# EAGLE schematic motor_driver_analog (EAGLE 6.2)
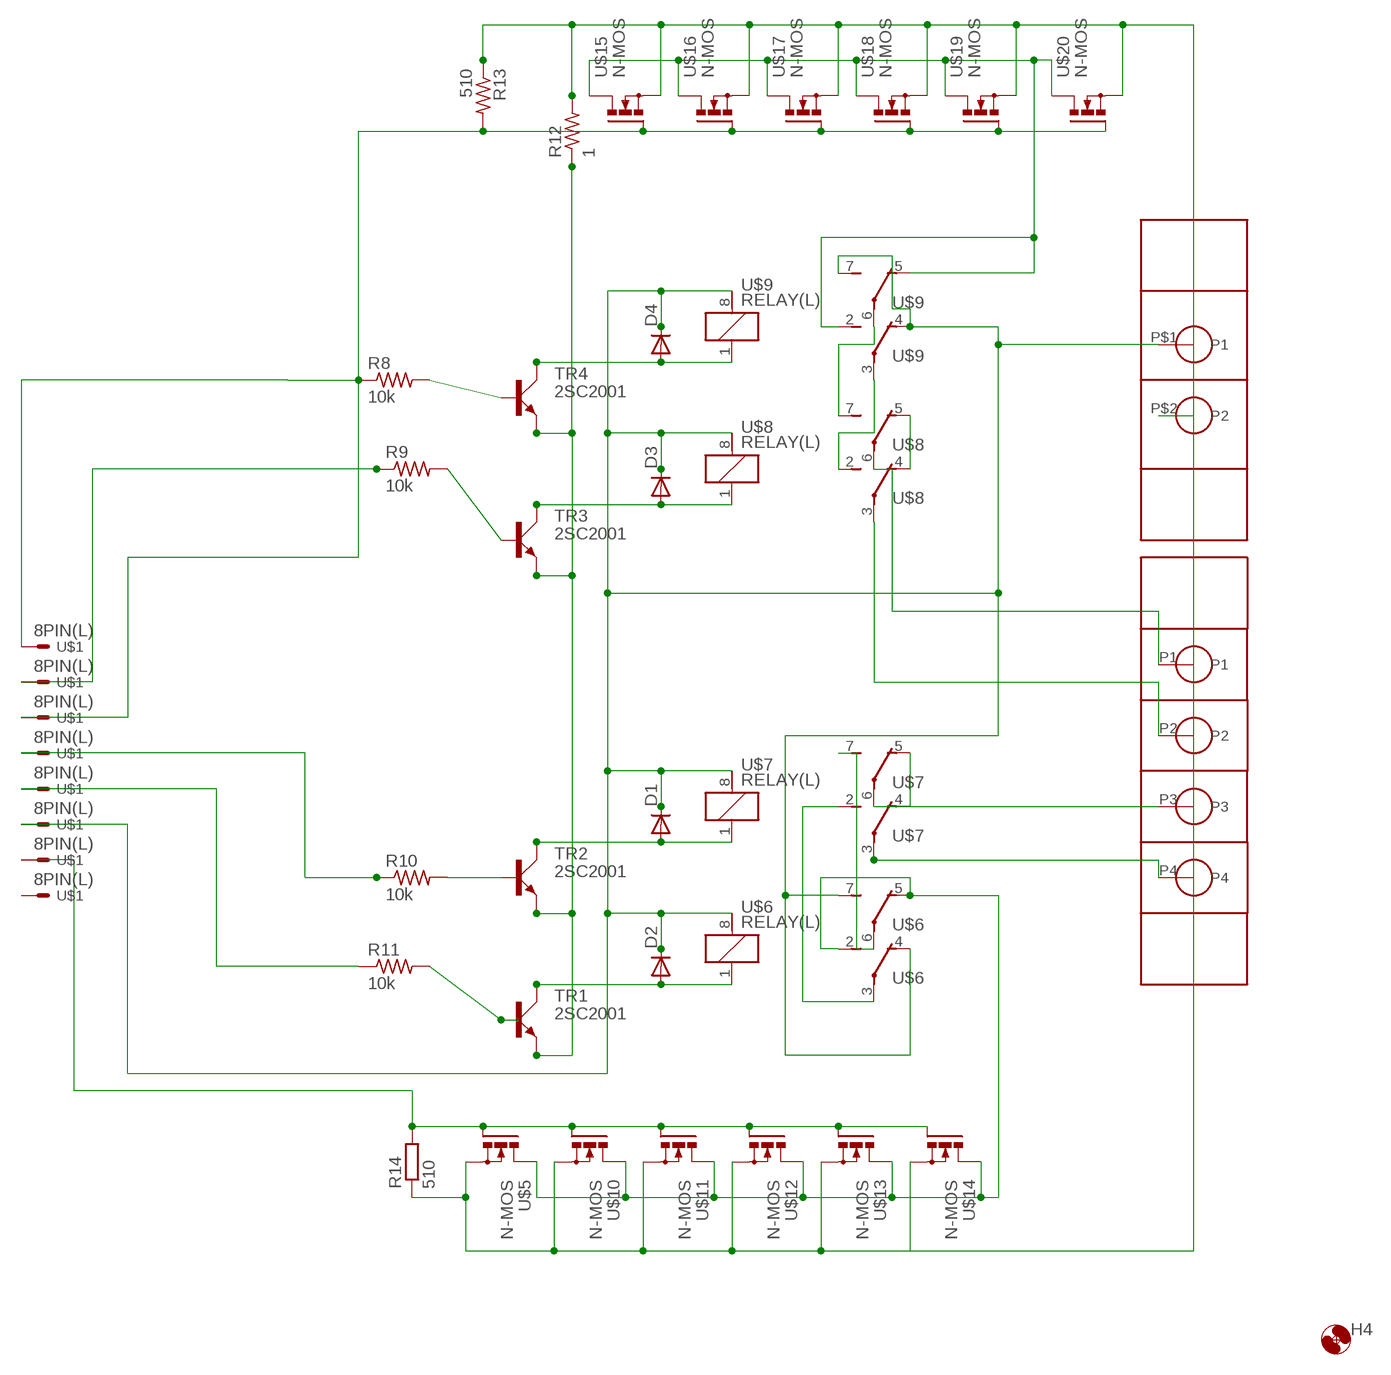
[diagram p0: schematic, sheet 1]

## Parts
D1  DIODE7.5  [DIODE7.5]
D2  DIODE7.5  [DIODE7.5]
D3  DIODE7.5  [DIODE7.5]
D4  DIODE7.5  [DIODE7.5]
H4  HOLE3.3M3BOLT  [HOLE3.3]
R8  10k  R-  [0207/10]
R9  10k  R-  [0207/10]
R10  10k  R-  [0207/10]
R11  10k  R-  [0207/10]
R12  1  R-  [0207/10]
R13  510  R-  [0207/10]
R14  510  R-EU2R0207V  [R0207V]
TR1  2SC2001  [TO92BCE]
TR2  2SC2001  [TO92BCE]
TR3  2SC2001  [TO92BCE]
TR4  2SC2001  [TO92BCE]
U$1  8PIN(L)  [8PL]
U$2  BP341L  [BP341L]
U$4  BP341L_1  [BP341L]
U$5  N-MOS  [TO220BV]
U$6  RELAY(L)  [G2R2]
U$7  RELAY(L)  [G2R2]
U$8  RELAY(L)  [G2R2]
U$9  RELAY(L)  [G2R2]
U$10  N-MOS  [TO220BV]
U$11  N-MOS  [TO220BV]
U$12  N-MOS  [TO220BV]
U$13  N-MOS  [TO220BV]
U$14  N-MOS  [TO220BV]
U$15  N-MOS  [TO220BV]
U$16  N-MOS  [TO220BV]
U$17  N-MOS  [TO220BV]
U$18  N-MOS  [TO220BV]
U$19  N-MOS  [TO220BV]
U$20  N-MOS  [TO220BV]

## Nets
12V: D1.PK(C) D2.PK(C) D3.PK(C) D4.PK(C) U$1.P3 U$4.P$1(P1) U$6.4(R2:O) U$6.7(R1:S) U$6.8 U$7.8 U$8.8 U$9.4(R2:O) U$9.7(R1:S) U$9.8
FET_G1: R13.2 U$1.P6 U$15.G U$16.G U$17.G U$18.G U$19.G U$20.G
FET_G2: R14.2 U$1.P2 U$5.G U$10.G U$11.G U$12.G U$13.G U$14.G
GND2: R12.2 R13.1 R14.1 U$4.P$2(P2) U$5.S U$10.S U$11.S U$12.S U$13.S U$14.S U$15.S U$16.S U$17.S U$18.S U$19.S U$20.S
GND3: R12.1 TR1.E TR2.E TR3.E TR4.E
MOS_D1: U$5.D U$6.2(R2:S) U$6.5(R1:O) U$10.D U$11.D U$12.D U$13.D U$14.D
MOS_D2: U$9.2(R2:S) U$9.5(R1:O) U$15.D U$16.D U$17.D U$18.D U$19.D U$20.D
N$23: R8.1 U$1.P8
N$24: R9.1 U$1.P7
N$25: R10.1 U$1.P5
N$26: R11.1 U$1.P4
N$27: R11.2 TR1.B
N$29: D4.PA(A) TR4.C U$9.1
N$30: D3.PA(A) TR3.C U$8.1
N$31: D1.PA(A) TR2.C U$7.1
N$32: D2.PA(A) TR1.C U$6.1
N$34: U$2.P3 U$7.6(R1:P)
N$40: U$8.7(R1:S) U$9.6(R1:P)
N$41: U$8.2(R2:S) U$9.3(R2:P)
N$42: U$8.4(R2:O) U$8.5(R1:O)
N$43: R8.2 TR4.B
N$44: R9.2 TR3.B
N$45: R10.2 TR2.B
N$46: U$2.P2 U$8.3(R2:P)
N$47: U$2.P1 U$8.6(R1:P)
N$48: U$2.P4 U$7.3(R2:P)
N$50: U$6.6(R1:P) U$7.7(R1:S)
N$51: U$6.3(R2:P) U$7.2(R2:S)
N$53: U$7.4(R2:O) U$7.5(R1:O)
Unconnected: U$1.P1

## Library data of the parts
D1-D4 = diode:DIODE7.5
H4 = FP-21T for MITS:HOLE3.3
R8-R13 = My_rcl:R-: Resistor
R14 = FP-21T for MITS:R-EU2
TR1-TR4 = My_transistor:2SC2001: NPN Transistor
U$1 = my_connector:8PIN(L)
U$2 = BP341_4PIN:BP341L
U$4 = BP341L_1:BP341L_1
U$5 U$10-U$20 = FET_kai:N-MOS
U$6-U$9 = relay:RELAY(L)